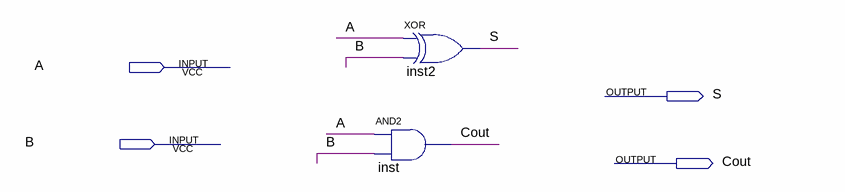
[diagram p0: schematic sheet]
// Quartus schematic Half Adder.bdf as structural Verilog: 2 symbols, 4 pins
module \Half_Adder  (
  input  A,
  input  B,
  output S,
  output Cout
);

  xor inst2 (S, A, B);
  and inst (Cout, A, B);
endmodule
